# EasyEDA schematic SCH_RightHalf_2022-04-16.json
TITLE: LeftHalf; REV: 1.0; Date: 2022-04-03; Sheet: 1/1; Drawn By: 羊RZ; Company: Your Company
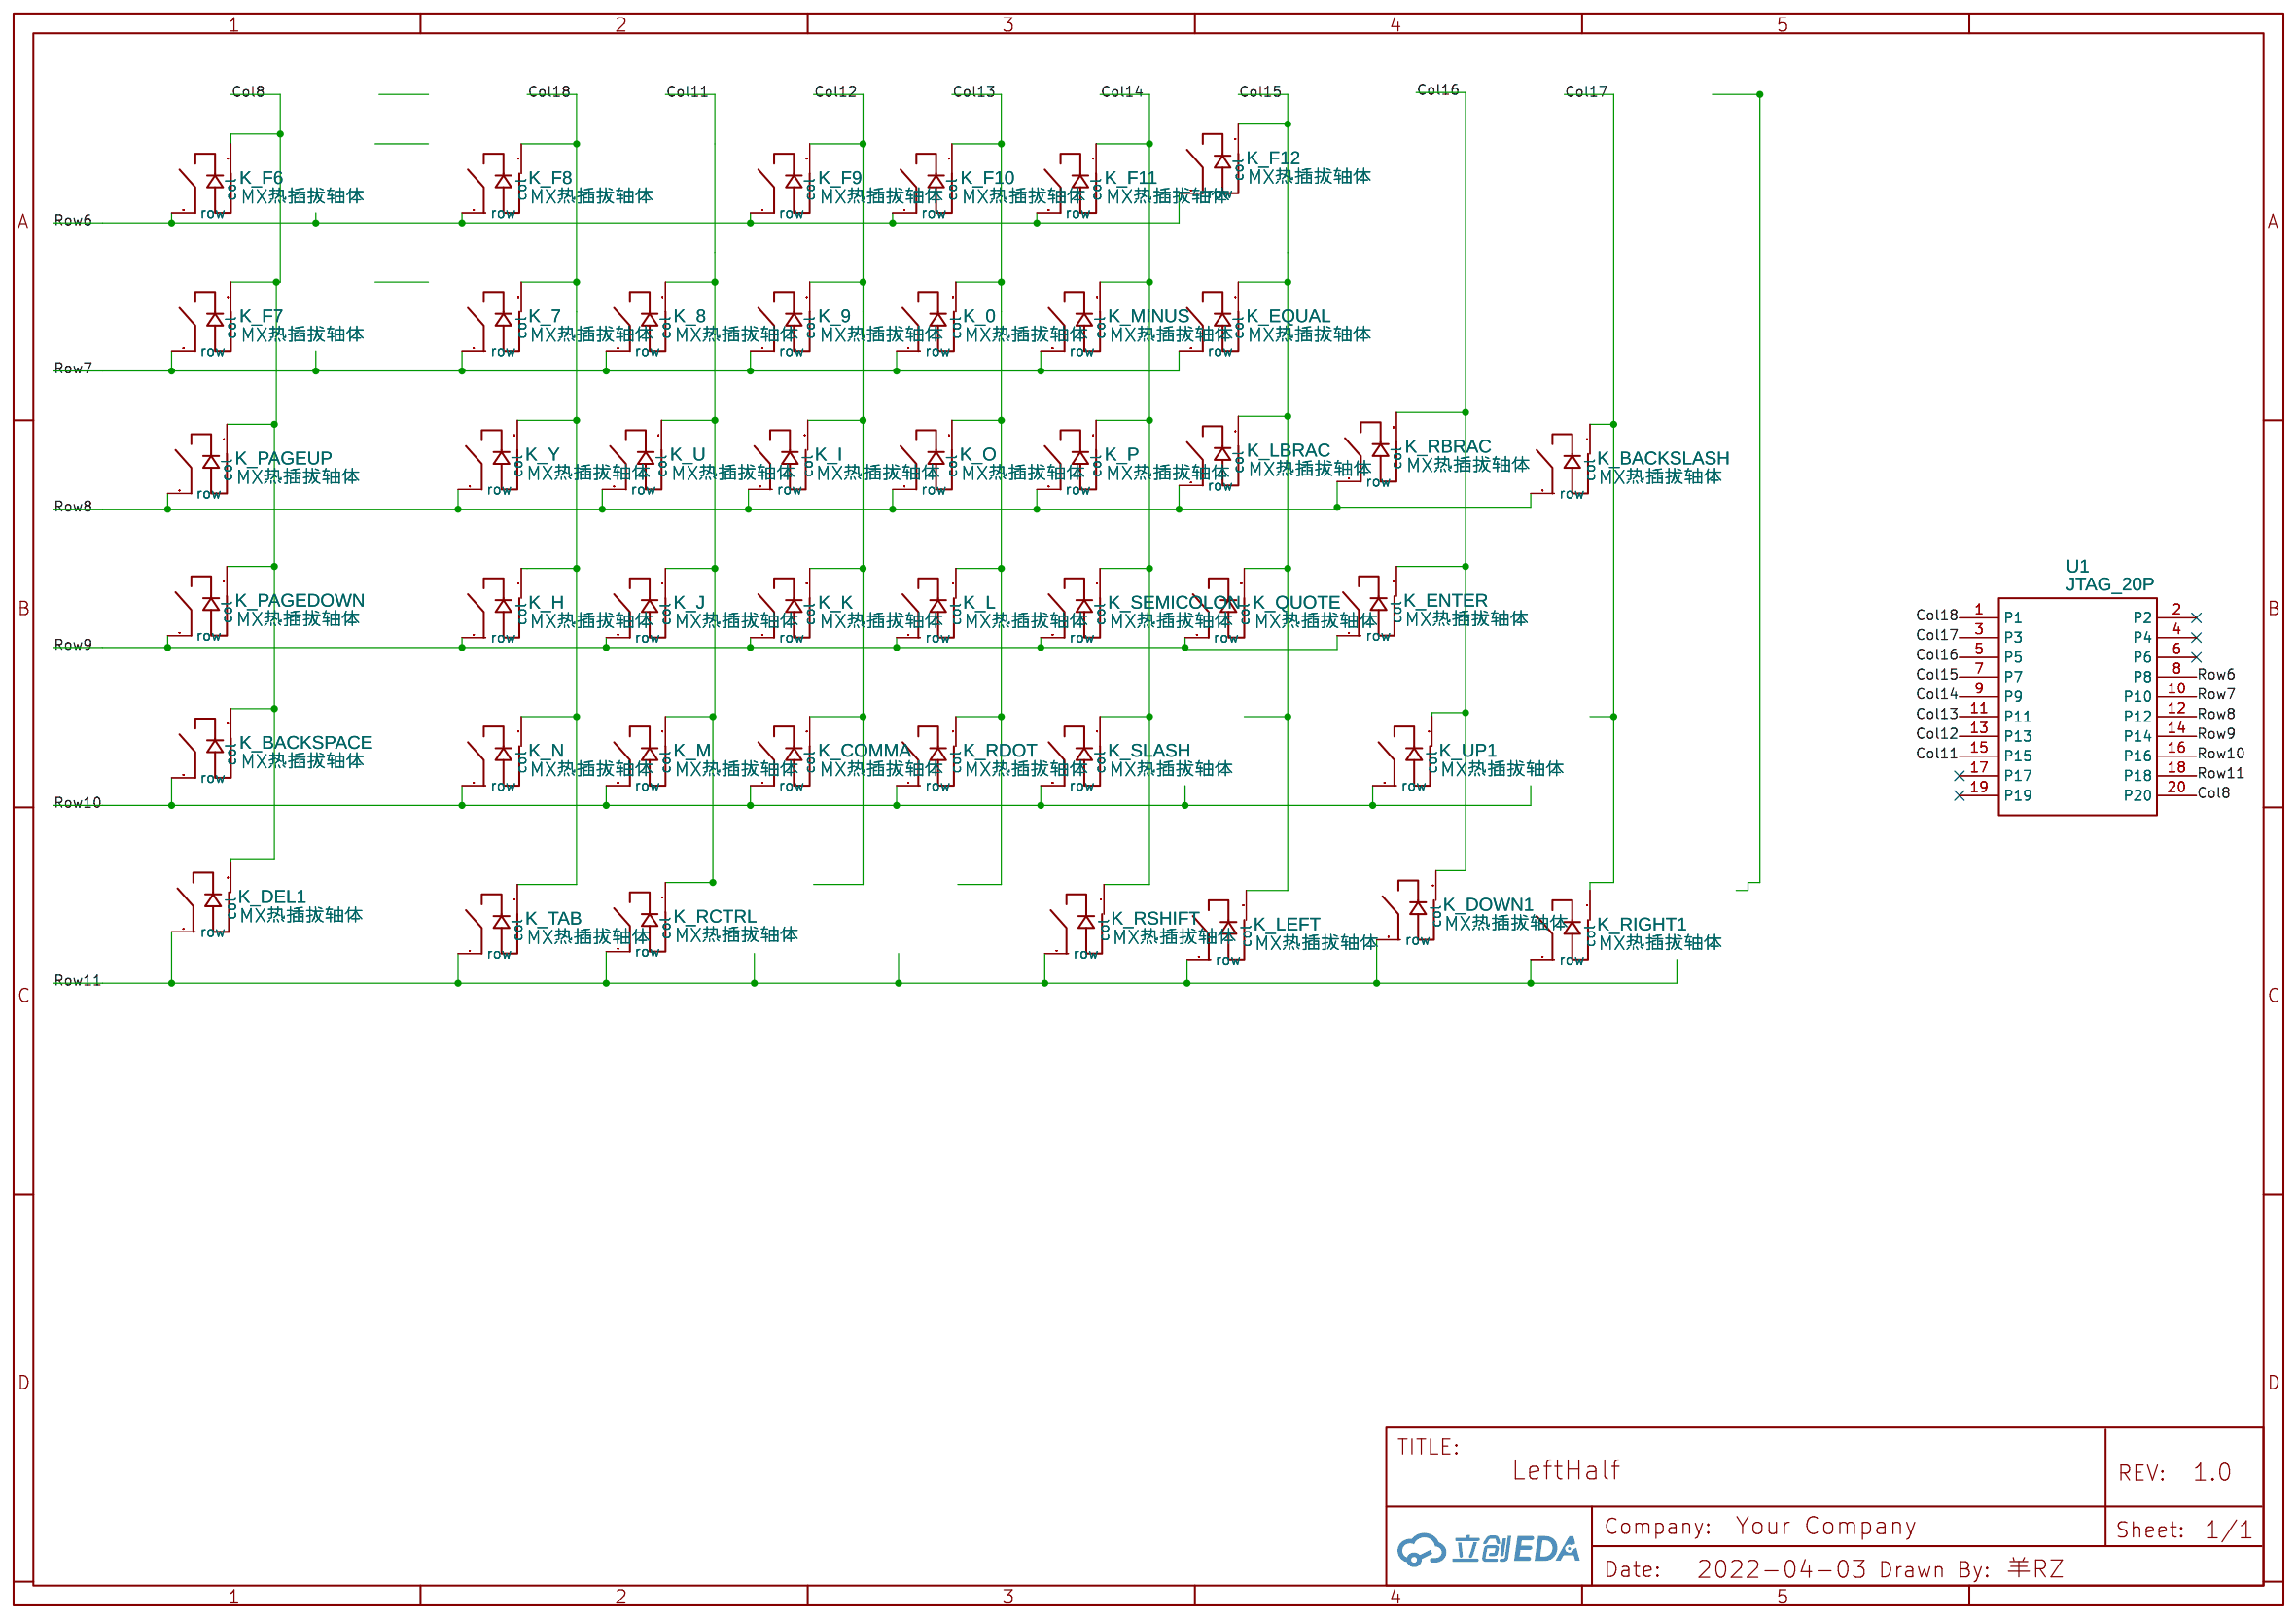
[diagram p0: schematic sheet]

## Parts
K_0  MX热插拔轴体  [凯华热插拔+1N4148]
K_7  MX热插拔轴体  [凯华热插拔+1N4148]
K_8  MX热插拔轴体  [凯华热插拔+1N4148]
K_9  MX热插拔轴体  [凯华热插拔+1N4148]
K_BACKSLASH  MX热插拔轴体  [凯华热插拔+1N4148]
K_BACKSPACE  MX热插拔轴体  [凯华热插拔+1N4148]
K_COMMA  MX热插拔轴体  [凯华热插拔+1N4148]
K_DEL1  MX热插拔轴体  [凯华热插拔+1N4148]
K_DOWN1  MX热插拔轴体  [凯华热插拔+1N4148]
K_ENTER  MX热插拔轴体  [凯华热插拔+1N4148]
K_EQUAL  MX热插拔轴体  [凯华热插拔+1N4148]
K_F6  MX热插拔轴体  [凯华热插拔+1N4148]
K_F7  MX热插拔轴体  [凯华热插拔+1N4148]
K_F8  MX热插拔轴体  [凯华热插拔+1N4148]
K_F9  MX热插拔轴体  [凯华热插拔+1N4148]
K_F10  MX热插拔轴体  [凯华热插拔+1N4148]
K_F11  MX热插拔轴体  [凯华热插拔+1N4148]
K_F12  MX热插拔轴体  [凯华热插拔+1N4148]
K_H  MX热插拔轴体  [凯华热插拔+1N4148]
K_I  MX热插拔轴体  [凯华热插拔+1N4148]
K_J  MX热插拔轴体  [凯华热插拔+1N4148]
K_K  MX热插拔轴体  [凯华热插拔+1N4148]
K_L  MX热插拔轴体  [凯华热插拔+1N4148]
K_LBRAC  MX热插拔轴体  [凯华热插拔+1N4148]
K_LEFT  MX热插拔轴体  [凯华热插拔+1N4148]
K_M  MX热插拔轴体  [凯华热插拔+1N4148]
K_MINUS  MX热插拔轴体  [凯华热插拔+1N4148]
K_N  MX热插拔轴体  [凯华热插拔+1N4148]
K_O  MX热插拔轴体  [凯华热插拔+1N4148]
K_P  MX热插拔轴体  [凯华热插拔+1N4148]
K_PAGEDOWN  MX热插拔轴体  [凯华热插拔+1N4148]
K_PAGEUP  MX热插拔轴体  [凯华热插拔+1N4148]
K_QUOTE  MX热插拔轴体  [凯华热插拔+1N4148]
K_RBRAC  MX热插拔轴体  [凯华热插拔+1N4148]
K_RCTRL  MX热插拔轴体  [凯华热插拔+1N4148]
K_RDOT  MX热插拔轴体  [凯华热插拔+1N4148]
K_RIGHT1  MX热插拔轴体  [凯华热插拔+1N4148]
K_RSHIFT  MX热插拔轴体  [凯华热插拔+1N4148]
K_SEMICOLON  MX热插拔轴体  [凯华热插拔+1N4148]
K_SLASH  MX热插拔轴体  [凯华热插拔+1N4148]
K_TAB  MX热插拔轴体  [凯华热插拔+1N4148]
K_U  MX热插拔轴体  [凯华热插拔+1N4148]
K_UP1  MX热插拔轴体  [凯华热插拔+1N4148]
K_Y  MX热插拔轴体  [凯华热插拔+1N4148]
U1  JTAG_20P  [JTAG-20PIN-2.54MM-PTH]

## Library data of the parts
K_0 K_7-K_9 K_BACKSLASH K_BACKSPACE K_COMMA K_DEL1 K_DOWN1 K_ENTER K_EQUAL K_F6-K_F12 K_H K_I K_J K_K K_L K_LBRAC K_LEFT K_M K_MINUS K_N K_O K_P K_PAGEDOWN K_PAGEUP K_QUOTE K_RBRAC K_RCTRL K_RDOT K_RIGHT1 K_RSHIFT K_SEMICOLON K_SLASH K_TAB K_U K_UP1 K_Y = MX热插拔轴体: Contributor: youngfar
U1 = JTAG_20P: Contributor: phtcnt_yan

## Nets
Col8: K_BACKSPACE.COL(col) K_DEL1.COL(col) K_F6.COL(col) K_F7.COL(col) K_PAGEDOWN.COL(col) K_PAGEUP.COL(col) U1.20(P20)
Col11: K_8.COL(col) K_J.COL(col) K_M.COL(col) K_RCTRL.COL(col) K_U.COL(col) U1.15(P15)
Col12: K_9.COL(col) K_COMMA.COL(col) K_F9.COL(col) K_I.COL(col) K_K.COL(col) U1.13(P13)
Col13: K_0.COL(col) K_F10.COL(col) K_L.COL(col) K_O.COL(col) K_RDOT.COL(col) U1.11(P11)
Col14: K_F11.COL(col) K_MINUS.COL(col) K_P.COL(col) K_RSHIFT.COL(col) K_SEMICOLON.COL(col) K_SLASH.COL(col) U1.9(P9)
Col15: K_EQUAL.COL(col) K_F12.COL(col) K_LBRAC.COL(col) K_LEFT.COL(col) K_QUOTE.COL(col) U1.7(P7)
Col16: K_DOWN1.COL(col) K_ENTER.COL(col) K_RBRAC.COL(col) K_UP1.COL(col) U1.5(P5)
Col17: K_BACKSLASH.COL(col) K_RIGHT1.COL(col) U1.3(P3)
Col18: K_7.COL(col) K_F8.COL(col) K_H.COL(col) K_N.COL(col) K_TAB.COL(col) K_Y.COL(col) U1.1(P1)
Row6: K_F6.ROW(row) K_F8.ROW(row) K_F9.ROW(row) K_F10.ROW(row) K_F11.ROW(row) K_F12.ROW(row) U1.8(P8)
Row7: K_0.ROW(row) K_7.ROW(row) K_8.ROW(row) K_9.ROW(row) K_EQUAL.ROW(row) K_F7.ROW(row) K_MINUS.ROW(row) U1.10(P10)
Row8: K_BACKSLASH.ROW(row) K_I.ROW(row) K_LBRAC.ROW(row) K_O.ROW(row) K_P.ROW(row) K_PAGEUP.ROW(row) K_RBRAC.ROW(row) K_U.ROW(row) K_Y.ROW(row) U1.12(P12)
Row9: K_ENTER.ROW(row) K_H.ROW(row) K_J.ROW(row) K_K.ROW(row) K_L.ROW(row) K_PAGEDOWN.ROW(row) K_QUOTE.ROW(row) K_SEMICOLON.ROW(row) U1.14(P14)
Row10: K_BACKSPACE.ROW(row) K_COMMA.ROW(row) K_M.ROW(row) K_N.ROW(row) K_RDOT.ROW(row) K_SLASH.ROW(row) K_UP1.ROW(row) U1.16(P16)
Row11: K_DEL1.ROW(row) K_DOWN1.ROW(row) K_LEFT.ROW(row) K_RCTRL.ROW(row) K_RIGHT1.ROW(row) K_RSHIFT.ROW(row) K_TAB.ROW(row) U1.18(P18)

Not connected (* = marked no-connect by the designer): U1 2(P2)* 4(P4)* 6(P6)* 17(P17)* 19(P19)*
